# Altium schematic sheet Main.SchDoc
size A
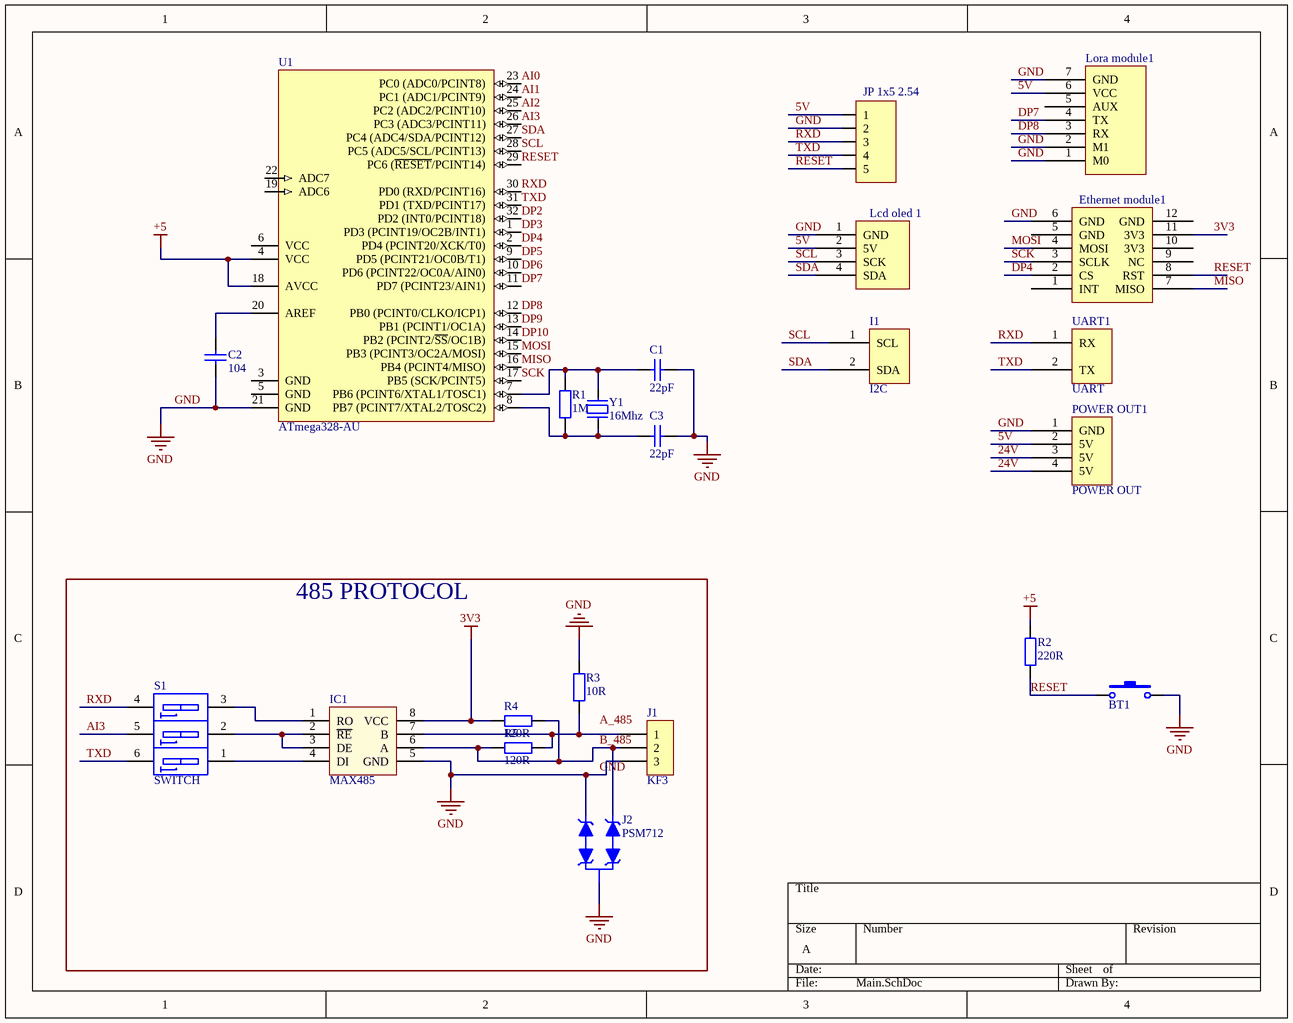
[diagram p0: Main.SchDoc]

## Parts
BT1  Nut Nhan 2 Chan SMD 3x6x2.5  [Nut Nhan 2 Chan SMD 3x6x2.5]  (value not drawn)
C1  22pF  [tu 0603]
C2  104  [tu 0603]
C3  22pF  [tu 0603]
Ethernet_module1  Ethernet module  [Ethernet module - duplicate]  (value not drawn)
I1  I2C  [KF2-5.08]
IC1  MAX485  [SO8]
J1  KF3  [KF3-5.08]
J2  PSM712  [SOT23-3]
JP1  JP 1x5 2.54  [JP 1x5 CT]
Lcd_oled_1  Lcd oled 1306 module  [LCD 1306 - duplicate]  (value not drawn)
Lora_module1  Lora module  [LORA E32]  (value not drawn)
POWER_OUT1  POWER OUT  [KF4-5.08]
R1  1M  [tro smd 0805]
R2  220R  [tro smd 0603]
R3  10R  [tro smd 0805]
R4  120R  [tro smd 0805]
R5  120R  [tro smd 0805]
S1  SWITCH  [SW-DIP3]
U1  ATmega328-AU  [TQFP32]
UART1  UART  [KF2-5.08]
Y1  16Mhz  [Thach Anh 2 chan SMD]

## Blocks framed on the sheet
485 PROTOCOL: IC1 J1 J2 R3-R5 S1

## Nets
3V3: Ethernet_module1.11(3V3) IC1.8(VCC) R4.1
+5: R2.2 U1.4(VCC) U1.18(AVCC)
GND: BT1.2 C1.2 C2.2 C3.2 Ethernet_module1.6(GND) IC1.5(GND) J1.3 J2.2(A1) J2.3(C) JP1.2 Lcd_oled_1.1(GND) Lora_module1.1(M0) Lora_module1.2(M1) Lora_module1.7(GND) POWER_OUT1.1(GND) R3.1 U1.21(GND)
5V: JP1.1 Lcd_oled_1.2(5V) Lora_module1.6(VCC) POWER_OUT1.2(5V)
24V: POWER_OUT1.3(5V) POWER_OUT1.4(5V)
AI0: U1.23(PC0_(ADC0/PCINT8))
AI1: U1.24(PC1_(ADC1/PCINT9))
AI2: U1.25(PC2_(ADC2/PCINT10))
AI3: S1.5 U1.26(PC3_(ADC3/PCINT11))
B_485: IC1.6(A) J1.2 J2.1(A) R4.2 R5.1
DP2: U1.32(PD2_(INT0/PCINT18))
DP3: U1.1(PD3_(PCINT19/OC2B/INT1))
DP4: Ethernet_module1.2(CS) U1.2(PD4_(PCINT20/XCK/T0))
DP5: U1.9(PD5_(PCINT21/OC0B/T1))
DP6: U1.10(PD6_(PCINT22/OC0A/AIN0))
DP7: Lora_module1.4(TX) U1.11(PD7_(PCINT23/AIN1))
DP8: Lora_module1.3(RX) U1.12(PB0_(PCINT0/CLKO/ICP1))
DP9: U1.13(PB1_(PCINT1/OC1A))
DP10: U1.14(PB2_(PCINT2/~{SS}/OC1B))
MISO: Ethernet_module1.7(MISO) U1.16(PB4_(PCINT4/MISO))
MOSI: Ethernet_module1.4(MOSI) U1.15(PB3_(PCINT3/OC2A/MOSI))
RESET: BT1.1 Ethernet_module1.8(RST) JP1.5 R2.1 U1.29(PC6_(~{RESET}/PCINT14))
RXD: JP1.3 S1.4 U1.30(PD0_(RXD/PCINT16)) UART1.1(RX)
SCK: Ethernet_module1.3(SCLK) U1.17(PB5_(SCK/PCINT5))
SCL: I1.1(SCL) Lcd_oled_1.3(SCK) U1.28(PC5_(ADC5/SCL/PCINT13))
SDA: I1.2(SDA) Lcd_oled_1.4(SDA) U1.27(PC4_(ADC4/SDA/PCINT12))
TXD: JP1.4 S1.6 U1.31(PD1_(TXD/PCINT17)) UART1.2(TX)
NetC1_1: C1.1 R1.1 U1.7(PB6_(PCINT6/XTAL1/TOSC1)) Y1.1
NetC2_1: C2.1 U1.20(AREF)
NetC3_1: C3.1 R1.2 U1.8(PB7_(PCINT7/XTAL2/TOSC2)) Y1.2
NetIC1_1: IC1.1(RO) S1.3
NetIC1_2: IC1.2(~{RE}) IC1.3(DE) S1.2
NetIC1_4: IC1.4(DI) S1.1
NetIC1_7: IC1.7(B) J1.1 R3.2 R5.2

Not connected (* = marked no-connect by the designer): Ethernet_module1 1(INT) 5(GND) 9(NC) 10(3V3) 12(GND); Lora_module1 5(AUX); U1 3(GND) 5(GND) 6(VCC) 19(ADC6) 22(ADC7)

## Notes on the sheet
- Labels drawn without touching a wire or pin: A_485

## Library data of the parts
BT1 = Nut Nhan 2 Chan SMD 3x6x2.5: Ma_Hang: MH001036; Ten: Nút Nhấn 2 Chân 3x6x2.5MM SMD
C1 C3 = Tu 0603 22pF 50V 10%: Dán; Don_Vi: Con; So_Chan: 2; Ten_Linh_Kien: Tụ 0603 22pF 50V 10%; Ma_Hang: MH004570; Chung_Loai: Dán; Kieu_Chan: *
C2 = Tu 0603 104 50V 10%: Dán; Don_Vi: Con; So_Chan: 2; Ten_Linh_Kien: Tụ 0603 104-100nF 10% 50V; Ma_Hang: MH004568; Chung_Loai: Dán; Kieu_Chan: *
IC1 = MAX485: RS232 - RS485 (Same sn75176)
J1 = KF3: Manufacturer: Würth Elektronik eiSos GmbH; partNo: 691103110003; ComponentLink1 Description: Manufacturer; ComponentLink2 Description: Datasheet; NoPins: 3; Created Date: 29 October 2013; ComponentLink1URL: http://www.we-online.com; ComponentLink2URL: http://katalog.we-online.de/em/datasheet/6911031100xx.pdf; Created by: Karrer Zheng
J2 = PSM712: 19V Clamp 1A (8/20Âµs) Ipp Tvs Diode Surface Mount SOT-23; MF: Protek Devices; SnapEDA_Link: https://www.snapeda.com/parts/PSM712/Protek+Devices/view-part/?ref=snap; Value: *; Check_prices: https://www.snapeda.com/parts/PSM712/Protek+Devices/view-part/?ref=eda; Availability: In Stock; Price: None; MP: PSM712; Package: Package
JP1 = JP 1x5 2.54 Cai Thang: Cắm; Ten_Linh_Kien: Jump Đơn Cái 2.54MM 1x20P Thẳng; Don_Vi: Con; Ma_Hang: MH004006; Ghi_Chu: *; Kieu_Chan: *; Chung_Loai: Cắm
R1 = Tro 0805 5% 1M: Dán; Don_Vi: Con; So_Chan: 2; Ten_Linh_Kien: Trở 0805 5% 1M; Ma_Hang: MH005235; Chung_Loai: Dán; Kieu_Chan: *
R2 = Tro 0603 5% 220R: Dán; Don_Vi: Con; So_Chan: 2; Ten_Linh_Kien: Trở 0603 5% 220R; Ma_Hang: MH006322; Chung_Loai: Dán; Kieu_Chan: *
R3-R5 = Tro 0805 1% 10R: Dán; Don_Vi: Con; So_Chan: 2; Ten_Linh_Kien: Trở 0805 1% 10R; Ma_Hang: MH005474; Chung_Loai: Dán; Kieu_Chan: *
S1 = SWDIP3: WS-DITV 2.54 mm small compact THT flat actuator with top tape; Manufacturer: Wurth Elektronik; Part No.: 418127160901; ComponentLink1 Description: Manufacturer; ComponentLink2 Description: Datasheet; Pole: 01; Created Date: Dec.2015; ComponentLink1URL: http://www.we-online.com; ComponentLink2URL: http://katalog.we-online.de/em/datasheet/4181271609xx.pdf; Created by: Baojun Chen
U1 = ATmega328-AU: 8-bit AVR Microcontroller, 32KB Flash, 1KB EEPROM, 2KB SRAM, 32-pin TQFP, Industrial Grade (-40°C to 85°C); Published: 1-Apr-2010; DatasheetVersion: revA, Jan-2010; PackageVersion: revB, Oct-2001; PackageReference: 32A; Publisher: Altium Limited; PackageDescription: 32-Lead, 7x7x1.0 mm Body, 0.8mm Lead Pitch, Thin Profile Plastic Quad Flat Package (TQFP); Supplier 1: Digi-Key; Supplier Part Number 1: ATMEGA328-AU-ND; Supplier 2: Mouser; Supplier Part Number 2: 556-ATMEGA328-AU; Code_JEDEC: MS-026-ABA; ComponentLink1Description: Manufacturer Link; ComponentLink1URL: http://www.atmel.com/products/avr/default.asp?; ComponentLink2Description: ATmega48A/48PA/88A/88PA/168A/168PA/328/328P Datasheet; ComponentLink2URL: http://www.atmel.com/dyn/resources/prod_documents/8271.pdf; ComponentLink3Description: ATmega48A/48PA/88A/88PA/168A/168PA/328/328P Summary; ComponentLink3URL: http://www.atmel.com/dyn/resources/prod_documents/8271S.pdf; ComponentLink4Description: Atmel.com Home; ComponentLink4URL: http://www.atmel.com
Y1 = Thach Anh 2 chan SMD: Crystal For all Crystal 2pin.; Value: 4Mhz